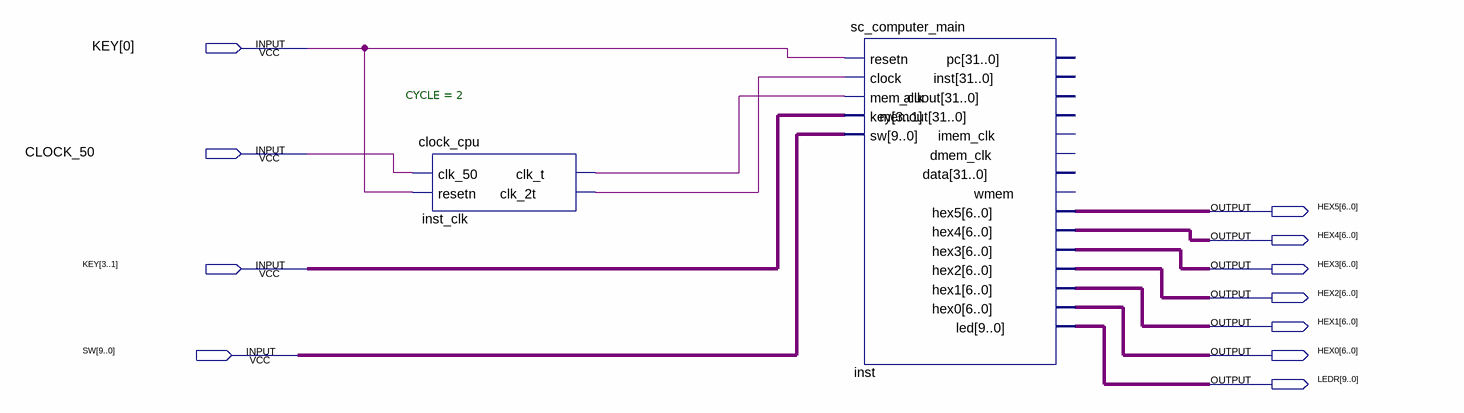
[diagram p0: schematic sheet]
// Quartus schematic exp_exam.bdf as structural Verilog: 2 symbols, 11 pins
module exp_exam (
  input  [3:0] KEY,
  input  CLOCK_50,
  input  [9:0] SW,
  output [6:0] HEX5,
  output [6:0] HEX4,
  output [6:0] HEX3,
  output [6:0] HEX2,
  output [6:0] HEX1,
  output [6:0] HEX0,
  output [9:0] LEDR
);

  wire inst_clk_clk_2t, inst_clk_clk_t;

  clock_cpu #(.CYCLE(2)) inst_clk (
    .clk_50(CLOCK_50), .resetn(KEY[0]), .clk_t(inst_clk_clk_t), .clk_2t(inst_clk_clk_2t));
  sc_computer_main inst (
    .resetn(KEY[0]), .clock(inst_clk_clk_2t), .mem_clk(inst_clk_clk_t), .key(KEY[3:1]), .sw(SW), .hex5(HEX5),
    .hex4(HEX4), .hex3(HEX3), .hex2(HEX2), .hex1(HEX1), .hex0(HEX0), .led(LEDR));  // open: pc, inst, aluout, memout, imem_clk, dmem_clk, data, wmem
endmodule
